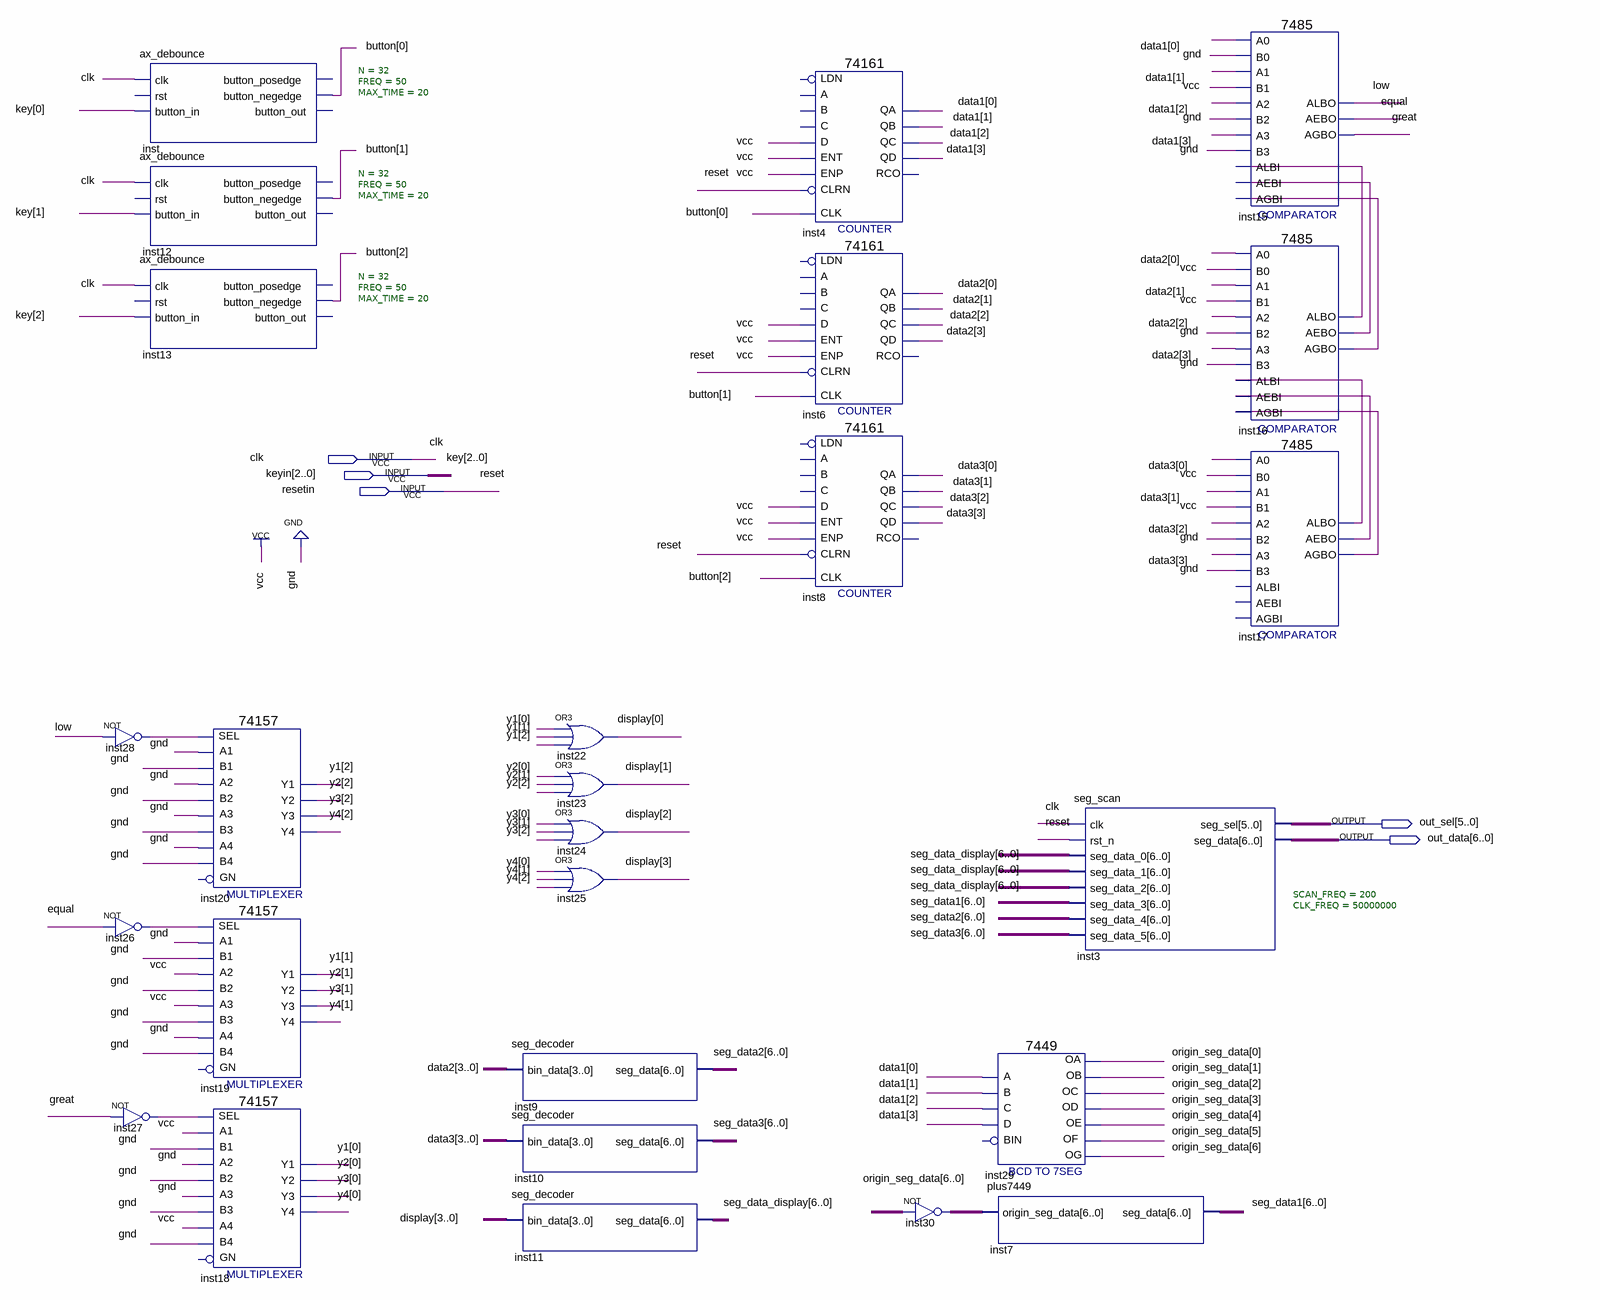
[diagram p0: schematic sheet]
// Quartus schematic NumbLock.bdf as structural Verilog: 26 symbols, 5 pins
module NumbLock (
  input  clk,
  input  [2:0] keyin,
  input  resetin,
  output [5:0] out_sel,
  output [6:0] out_data
);

  wire equal, great, inst16_aebo, inst16_agbo, inst16_albo, inst17_aebo, inst17_agbo, inst17_albo,
       inst26_out, inst27_out, inst28_out, low;
  wire [2:0] button, y1, y2, y3, y4;
  wire [3:0] data1, data2, data3, display;
  wire [6:0] inst30_out, origin_seg_data, seg_data1, seg_data2, seg_data3, seg_data_display;

  not inst28 (inst28_out, low);
  not inst26 (inst26_out, equal);
  not inst27 (inst27_out, great);
  ax_debounce #(.N(32), .FREQ(50), .MAX_TIME(20)) inst (
    .clk(clk), .button_in(keyin[0]), .button_negedge(button[0]));  // open: rst, button_posedge, button_out
  ax_debounce #(.N(32), .FREQ(50), .MAX_TIME(20)) inst12 (
    .clk(clk), .button_in(keyin[1]), .button_negedge(button[1]));  // open: rst, button_posedge, button_out
  ax_debounce #(.N(32), .FREQ(50), .MAX_TIME(20)) inst13 (
    .clk(clk), .button_in(keyin[2]), .button_negedge(button[2]));  // open: rst, button_posedge, button_out
  \74157  inst20 (
    .A1(1'b0), .B1(1'b0), .SEL(inst28_out), .B2(1'b0), .A3(1'b0), .B3(1'b0), .A2(1'b0), .B4(1'b0), .A4(1'b0),
    .Y2(y2[2]), .Y1(y1[2]), .Y4(y4[2]), .Y3(y3[2]));  // open: GN
  \74157  inst19 (
    .A1(1'b0), .B1(1'b0), .SEL(inst26_out), .B2(1'b0), .A3(1'b1), .B3(1'b0), .A2(1'b1), .B4(1'b0), .A4(1'b0),
    .Y2(y2[1]), .Y1(y1[1]), .Y4(y4[1]), .Y3(y3[1]));  // open: GN
  \74157  inst18 (
    .A1(1'b1), .B1(1'b0), .SEL(inst27_out), .B2(1'b0), .A3(1'b0), .B3(1'b0), .A2(1'b0), .B4(1'b0), .A4(1'b1),
    .Y2(y2[0]), .Y1(y1[0]), .Y4(y4[0]), .Y3(y3[0]));  // open: GN
  seg_decoder inst9 (.bin_data(data2), .seg_data(seg_data2));
  seg_decoder inst10 (.bin_data(data3), .seg_data(seg_data3));
  seg_decoder inst11 (.bin_data(display), .seg_data(seg_data_display));
  or inst22 (display[0], y1[0], y1[1], y1[2]);
  or inst23 (display[1], y2[0], y2[1], y2[2]);
  or inst24 (display[2], y3[0], y3[1], y3[2]);
  or inst25 (display[3], y4[0], y4[1], y4[2]);
  \74161  inst4 (
    .CLRN(resetin), .CLK(button[0]), .ENP(1'b1), .D(1'b1), .ENT(1'b1), .QD(data1[3]), .QC(data1[2]),
    .QB(data1[1]), .QA(data1[0]));  // open: LDN, A, B, C, RCO
  \74161  inst6 (
    .CLRN(resetin), .CLK(button[1]), .ENP(1'b1), .D(1'b1), .ENT(1'b1), .QD(data2[3]), .QC(data2[2]),
    .QB(data2[1]), .QA(data2[0]));  // open: LDN, A, B, C, RCO
  \74161  inst8 (
    .CLRN(resetin), .CLK(button[2]), .ENP(1'b1), .D(1'b1), .ENT(1'b1), .QD(data3[3]), .QC(data3[2]),
    .QB(data3[1]), .QA(data3[0]));  // open: LDN, A, B, C, RCO
  assign inst30_out = ~origin_seg_data;  // NOT inst30, 7 bits wide
  \7449  inst29 (
    .A(data1[0]), .C(data1[2]), .B(data1[1]), .D(data1[3]), .OC(origin_seg_data[2]), .OD(origin_seg_data[3]),
    .OF(origin_seg_data[5]), .OG(origin_seg_data[6]), .OB(origin_seg_data[1]), .OA(origin_seg_data[0]),
    .OE(origin_seg_data[4]));  // open: BIN
  plus7449 inst7 (.origin_seg_data(inst30_out), .seg_data(seg_data1));
  seg_scan #(.SCAN_FREQ(200), .CLK_FREQ(50000000)) inst3 (
    .clk(clk), .rst_n(resetin), .seg_data_0(seg_data_display), .seg_data_1(seg_data_display),
    .seg_data_2(seg_data_display), .seg_data_3(seg_data1), .seg_data_4(seg_data2), .seg_data_5(seg_data3),
    .seg_sel(out_sel), .seg_data(out_data));
  \7485  inst15 (
    .A3(data1[3]), .B2(1'b0), .A2(data1[2]), .AEBI(inst16_aebo), .AGBI(inst16_agbo), .ALBI(inst16_albo),
    .A0(data1[0]), .B0(1'b0), .B3(1'b0), .A1(data1[1]), .B1(1'b1), .ALBO(low), .AGBO(great), .AEBO(equal));
  \7485  inst16 (
    .A3(data2[3]), .B2(1'b0), .A2(data2[2]), .AEBI(inst17_aebo), .AGBI(inst17_agbo), .ALBI(inst17_albo),
    .A0(data2[0]), .B0(1'b1), .B3(1'b0), .A1(data2[1]), .B1(1'b1), .ALBO(inst16_albo), .AGBO(inst16_agbo),
    .AEBO(inst16_aebo));
  \7485  inst17 (
    .A3(data3[3]), .B2(1'b0), .A2(data3[2]), .A0(data3[0]), .B0(1'b1), .B3(1'b0), .A1(data3[1]), .B1(1'b1),
    .ALBO(inst17_albo), .AGBO(inst17_agbo), .AEBO(inst17_aebo));  // open: AEBI, AGBI, ALBI

  // Other names for the same wires on the sheet: key[2:0] = keyin; reset = resetin
endmodule
